# EAGLE design Rev2 (EAGLE 6.5.0)
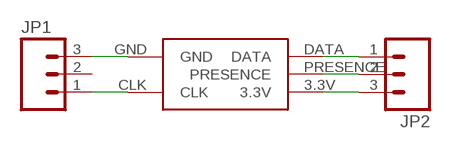
[diagram p0: schematic, sheet 1]

## Parts
JP1  M03PTH  [1X03]
JP2  M03PTH  [1X03]
U$1  NUNCHUCKLOCL  [NUNCHUCK-LOCK]

## Nets
3.3V: JP2.3 U$1.3.3V
CLK: JP1.1 U$1.CLK
DATA: JP2.1 U$1.DATA
GND: JP1.3 U$1.GND
PRESENCE: JP2.2 U$1.PRESENCE
Unconnected: JP1.2

## Library data of the parts
JP1 JP2 = SparkFun-Connectors:M03: Header 3 Standard 3-pin 0.1" header. Use with straight break away headers (SKU : PRT-00116), right angle break away headers (PRT-00553), swiss pins (PRT-00743), machine pins (PRT-00117), and female headers (PRT-00115). Molex polarized connector foot print use with SKU : PRT-08232 with associated crimp pins and housings.
U$1 = HHJ:NUNCHUCK

## Board
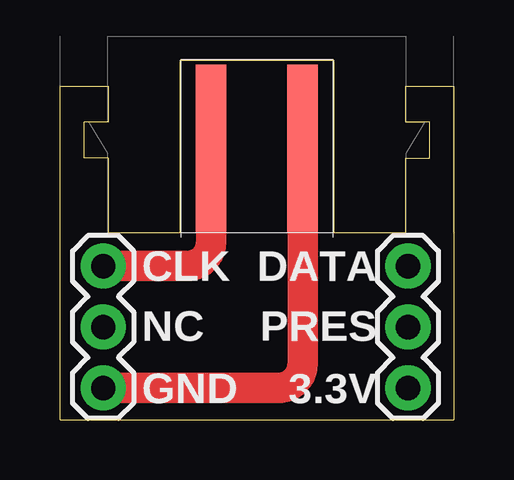
[diagram p1: board, top side]
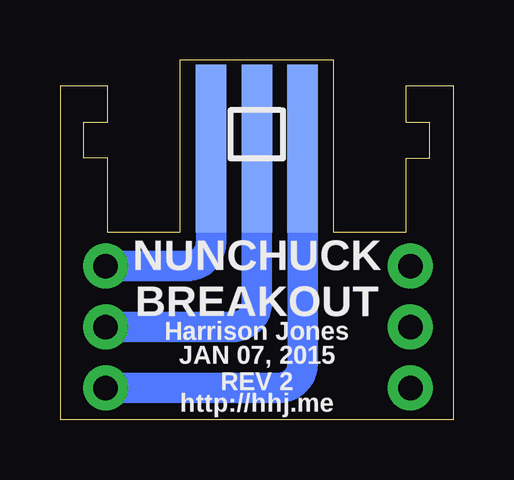
[diagram p2: board, bottom side, seen from below]

Size 16.4 x 15 mm. Coordinates in mm from the lower left corner, seen from the top.
Outline: 0,0 0,13.9 2,13.9 2,12.4 1,12.4 1,10.9 2,10.9 2,7.8 5,7.8 5,15 11.4,15 11.4,7.8 14.4,7.8 14.4,10.9 15.4,10.9 15.4,12.4 14.4,12.4 14.4,13.9 16.4,13.9 16.4,0 0,0
Copper layers (1*16): Top 0.035mm / dielectric 1.5mm / Bottom 0.035mm
Design rules "default": minimum track width 10mil, minimum drill 0.6mm, track to track 8mil, track to pad 8mil, pad to pad 8mil, via to via 8mil, smd to smd 8mil, copper to edge 40mil, drill to drill 8mil, minimum pad ring 10mil, minimum via ring 8mil, stop-mask expansion 4mil, vias tented up to drill 0mil, thermal gap 10mil

### Footprints (pad centres in the part's own frame; a part is rotated, then mirrored left to right if it is on the bottom)
1X03 = drill 1.016 pad 1.88: 1 0,0; 2 2.54,0; 3 5.08,0
NUNCHUCK-LOCK = smd 1.27 x 6.985 bottom: 3.3V -1.905,1.5; DATA 1.905,1.5; PRESENCE 0,1.5 | smd 1.27 x 6.985: CLK -1.905,1.5; GND 1.905,1.5

### Placement (x,y rotation side)
JP1  1.8,6.4 270 top
JP2  14.5,6.4 270 top
U$1  8.2,9.8 0 top

### Tracks (layer width: path | path; a pad name or v marks a point on that pad's centre or on a via)
3.3V
  Bottom 1.27: U$1.3.3V 6.29,2.32 arc90 7.29,1.32 JP2.3
CLK
  Top 1.27: U$1.CLK 6.29,7.4 arc-90 5.29,6.4 JP1.1
DATA
  Bottom 1.27: U$1.DATA 10.11,7.4 arc90 11.11,6.4 JP2.1
GND
  Top 1.27: JP1.3 9.11,1.32 arc90 10.11,2.32 U$1.GND
PRESENCE
  Bottom 1.27: U$1.PRESENCE 8.2,4.86 arc90 9.2,3.86 JP2.2

### Text on the board
tPlace: CLK | DATA | NC | PRES | GND | 3.3V
bPlace: NUNCHUCK / BREAKOUT | Harrison Jones | JAN 07, 2015 | REV 2 | http://hhj.me